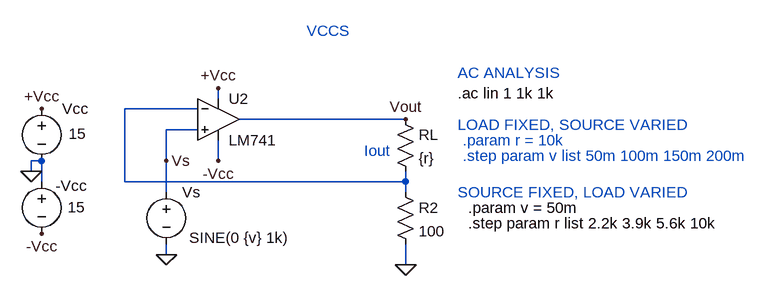
[diagram p0: schematic VCCS.asc]
VCCS.asc, the LTspice schematic file:
Version 4
SHEET 1 1236 680
WIRE 352 112 352 96
WIRE 320 128 208 128
WIRE 640 144 384 144
WIRE 320 160 272 160
WIRE 80 208 64 208
WIRE 272 208 272 160
WIRE 352 208 352 176
WIRE 64 224 64 208
WIRE 80 240 80 208
WIRE 208 240 208 128
WIRE 640 240 640 224
WIRE 640 240 208 240
WIRE 272 256 272 208
WIRE 640 256 640 240
WIRE 272 352 272 336
WIRE 640 368 640 336
FLAG 64 224 0
FLAG 80 128 +Vcc
FLAG 80 320 -Vcc
FLAG 352 96 +Vcc
FLAG 352 208 -Vcc
FLAG 272 352 0
FLAG 640 368 0
FLAG 640 144 Vout
FLAG 272 208 Vs
SYMBOL voltage 272 240 R0
WINDOW 3 35 86 Left 2
WINDOW 39 0 0 Left 2
SYMATTR Value SINE(0 {v} 1k)
SYMATTR InstName Vs
SYMATTR Value2 AC {v} 0
SYMBOL voltage 80 112 R0
WINDOW 0 32 16 Left 2
WINDOW 3 42 54 Left 2
WINDOW 123 0 0 Left 2
WINDOW 39 135 -14 Left 2
SYMATTR InstName Vcc
SYMATTR Value 15
SYMBOL voltage 80 224 R0
WINDOW 0 22 22 Left 2
WINDOW 3 40 55 Left 2
WINDOW 123 0 0 Left 2
WINDOW 39 131 -86 Left 2
SYMATTR InstName -Vcc
SYMATTR Value 15
SYMBOL Opamps\\LM741 352 80 R0
SYMATTR InstName U2
SYMBOL res 624 240 R0
SYMATTR InstName R2
SYMATTR Value 100
SYMBOL res 624 128 R0
SYMATTR InstName RL
SYMATTR Value {r}
TEXT 720 104 Left 2 !.ac lin 1 1k 1k
TEXT 736 280 Left 2 !.param v = 50m
TEXT 728 176 Left 2 ;.param r = 10k
TEXT 736 304 Left 2 !.step param r list 2.2k 3.9k 5.6k 10k
TEXT 728 200 Left 2 ;.step param v list 50m 100m 150m 200m
TEXT 488 8 Left 2 ;VCCS
TEXT 720 72 Left 2 ;AC ANALYSIS
TEXT 720 256 Left 2 ;SOURCE FIXED, LOAD VARIED
TEXT 720 152 Left 2 ;LOAD FIXED, SOURCE VARIED
TEXT 576 192 Left 2 ;Iout

The netlist it stands for:
* VCCS.asc
Vs Vs 0 SINE(0 {v} 1k) AC {v} 0
Vcc +Vcc 0 15
V§-Vcc 0 -Vcc 15
XU2 Vs N001 +Vcc -Vcc Vout LM741  ; pins In+ In- V+ V- OUT
R2 N001 0 100
RL Vout N001 {r}
.ac lin 1 1k 1k
.param v = 50m
* .param r = 10k
.step param r list 2.2k 3.9k 5.6k 10k
* .step param v list 50m 100m 150m 200m
* VCCS
* AC ANALYSIS
* SOURCE FIXED, LOAD VARIED
* LOAD FIXED, SOURCE VARIED
* Iout
.lib LM741.lib
.backanno
.end